# Altium schematic sheet SheetSensor.SchDoc
size A; DocumentNumber: 3; SheetNumber: 3; SheetTotal: 5
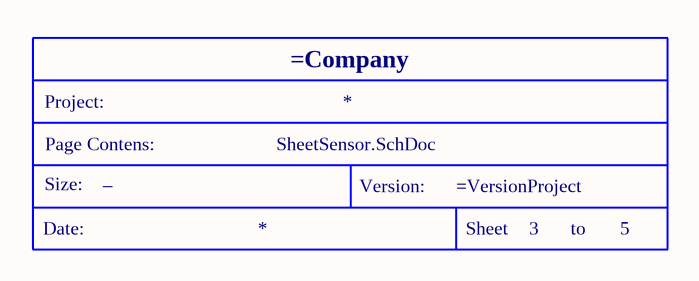
[diagram p0: SheetSensor.SchDoc]

## Parts
*  SizePage: _  (hidden comment: TitleBlock)  (graphical)

## Notes on the sheet
- (in symbol TitleBlock) Project:; Page Contens:; Size:; Version:; Date:; Sheet; to